# Altium schematic sheet D2_oldVersion.SchDoc
size A; SheetNumber: 1; SheetTotal: 1
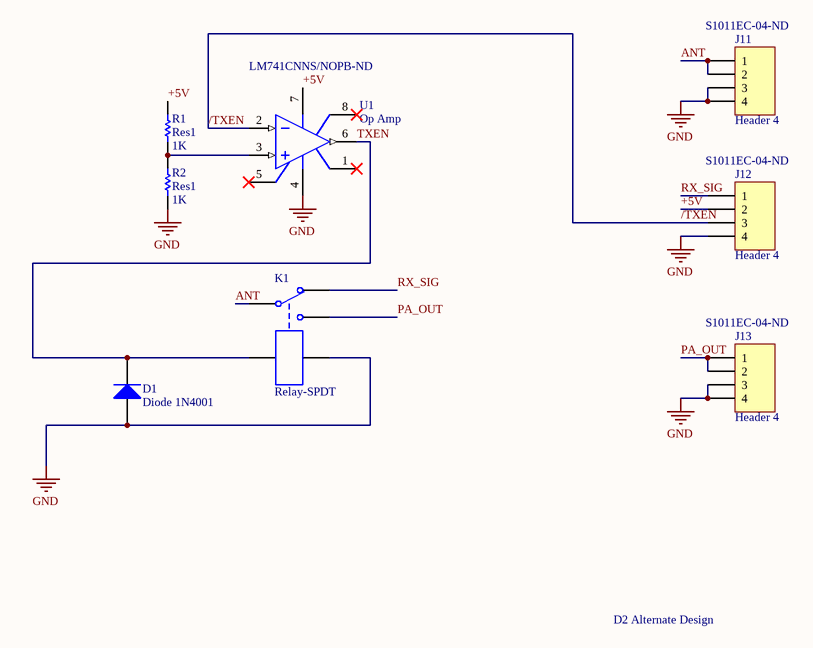
[diagram p0: D2_oldVersion.SchDoc]

## Parts
D1  Diode 1N4001  [DO-41]
J11  Header 4  Supplier Part Number 1: S1011EC-04-ND  [HDR1X4]
J12  Header 4  Supplier Part Number 1: S1011EC-04-ND  [HDR1X4]
J13  Header 4  Supplier Part Number 1: S1011EC-04-ND  [HDR1X4]
K1  Relay-SPDT  [MODULE5B]
R1  Res1  value 1K  [AXIAL-0.1-RES]
R2  Res1  value 1K  [AXIAL-0.1-RES]
U1  Op Amp  Supplier Part Number 1: LM741CNNS/NOPB-ND  [H-08A]

## Nets
GND: D1.1(A) J11.3 J11.4 J12.4 J13.3 J13.4 K1.5 R2.1 U1.4(V-)
+5V: J12.2 R1.2 U1.7(V+)
/TXEN: J12.3 U1.2(IN-)
ANT: J11.1 J11.2 K1.1
PA_OUT: J13.1 J13.2 K1.3
RX_SIG: J12.1 K1.2
TXEN: D1.2(K) K1.4 U1.6(OUT)
NetR1_1: R1.1 R2.2 U1.3(IN+)

Not connected (* = marked no-connect by the designer): U1 1(OS_NUL)* 5(OS_NUL)* 8(TAB)*

## Notes on the sheet
- D2 Alternate Design

## Library data of the parts
D1 = Diode 1N4001: 1 Amp General Purpose Rectifier; Published: 8-Jun-2000; LatestRevisionDate: 17-Jul-2002; LatestRevisionNote: Re-released for DXP Platform.; DatasheetVersion: 1998; PackageVersion: Aug-1999; PackageReference: DO-41; Publisher: Altium Limited; PackageDescription: Diode, Axial; Body 5.2 x 2.7 mm (LxDia. max), Lead Dia. 0.86 mm (max); Code_JEDEC: DO-204-AL; ComponentLink1Description: Manufacturer Link; ComponentLink1URL: http://www.fairchildsemi.com/; ComponentLink2Description: Datasheet; ComponentLink2URL: http://www.fairchildsemi.com/ds/1N%2F1N4001.pdf
J11-J13 = Header 4: Conn Header Vert 4POS 2.54MM; Manufacturer: Sullins; Manufacturer Part Number: PRPC004SAAN-RC; Number of Positions: 4; Connector Type: Male Pin; Pitch: 0.1inch; LatestRevisionDate: 17-Jul-2002; LatestRevisionNote: Re-released for DXP Platform.; Publisher: Altium Limited; Supplier 1: Digi-Key; RoHS: Yes; Category: Connectors; Stock 1: 11511; Pricing 1: 1=0.15000, 10=0.14600, 25=0.10840, 50=0.09280, 100=0.08980, 250=0.07740, 500=0.07430 (USD); Mount: Through Hole; Color: Black; Contact Plating: Gold; Package Quantity: 1; Number of Rows: 1; Packaging: Bulk; Termination: Solder; Series: -; Contact Type: Male Pin; Contact Mating Length: 0.23inch; RoHS Compliant: Yes; ComponentLink1URL: https://datasheet.ciiva.com/741/xrxczzzsxxn-rc-st-11635-b-741241.pdf?src-supplier=Digi-Key; ComponentLink1Description: https://datasheet.ciiva.com/741/xrxczzzsxxn-rc-st-11635-b-741241.pdf?src-supplier=Digi-Key
K1 = Relay-SPDT: Single-Pole Dual-Throw Relay; Published: 24-Mar-1999; LatestRevisionDate: 17-Jul-2002; LatestRevisionNote: Re-released for DXP Platform.; PackageReference: MODULE5B; Publisher: Altium Limited
R1 R2 = RES 1K OHM 5% 1/4W AXIAL: Resistor; Manufacturer Part Number: CFR-25JB-52-1K; Designator: R?; Power Rating: 1/4W; Tolerance: 0.05; Published: 8-Jun-2000; LatestRevisionDate: 17-Jul-2002; LatestRevisionNote: Re-released for DXP Platform.; Publisher: Altium Limited
U1 = Op Amp: Single 44V 1MHz operational amplifier 8-PDIP 0 to 70; Manufacturer: TI National Semiconductor; Manufacturer Part Number: LM741CN/NOPB; Gain Bandwidth Product: 1.5MHz; Slew Rate: 0.5V/µs; Number of Channels: 1; Input Bias Current: 80nA; Input Offset Voltage (Vos): 2mV; Voltage Gain: 106.02dB; Common Mode Rejection Ratio: 70dB; Max Dual Supply Voltage: 18V; Nominal Supply Current: 1.7mA; Output Current per Channel: 25mA; Power Dissipation: 500mW; Power Supply Rejection Ratio (PSRR): 77dB; Min Dual Supply Voltage: 5V; Amplifier Type: GENERAL PURPOSE; Max Supply Voltage: 36V; Min Supply Voltage: 10V; Max Supply Current: 2.8mA; Gain: 96dB; Published: 8-Jun-2000; LatestRevisionDate: 17-Jul-2002; LatestRevisionNote: Re-released for DXP Platform.; DatasheetVersion: REV. B; PackageVersion: 1990; PackageReference: H-08A; Publisher: Altium Limited; PackageDescription: Can; 8 Leads; Pin Circle Dia. 5.08 mm; Lead Dia. 0.53 mm (max); ComponentLink1Description: Manufacturer Link; ComponentLink1URL: http://www.analog.com/; Supplier 1: Digi-Key; RoHS: Yes; Category: Amplifiers - Op Amps, Buffer, Instrumentation; Stock 1: 4474; Pricing 1: 1=0.91000, 10=0.81300, 25=0.77160, 100=0.63390, 250=0.59256, 500=0.52364, 1000=0.45500 (USD); Mount: Through Hole; Case/Package: DIP; Number of Pins: 8; Contact Plating: Tin,Matte; Weight: 0.01lb; Min Operating Temperature: 0°C; Max Operating Temperature: 70°C; Packaging: Rail/Tube; Number of Elements: 1; Technology: BIPOLAR; Package Quantity: 40; Number of Circuits: 1; Operating Supply Current: 1.7mA; Output Current: 25mA; Supply Current: 1.7mA; Bandwidth: 1MHz; Number of Amplifiers: 1; Max Power Dissipation: 500mW; Voltage: 36V; Length: 9.27mm; Width: 6.35mm; Height: 3.3mm; Radiation Hardening: No; Lead Free: Lead Free; RoHS Compliant: Yes; REACH SVHC: No SVHC; ComponentLink2URL: https://datasheet.ciiva.com/26325/175935-da-01-en-ic-lm-741cn-nopb-dip8-tid-26325918.pdf?src-supplier=Conrad; ComponentLink2Description: https://datasheet.ciiva.com/26325/175935-da-01-en-ic-lm-741cn-nopb-dip8-tid-26325918.pdf?src-supplier=Conrad; ComponentLink3URL: https://datasheet.ciiva.com/26850/lm741cn-nopb-26850677.pdf?src-supplier=IIIC; ComponentLink3Description: https://datasheet.ciiva.com/26850/lm741cn-nopb-26850677.pdf?src-supplier=IIIC; ComponentLink4URL: https://datasheet.ciiva.com/14151/mflm741-data-e-14151370.pdf?src-supplier=Distrelec; ComponentLink4Description: https://datasheet.ciiva.com/14151/mflm741-data-e-14151370.pdf?src-supplier=Distrelec; ComponentLink5URL: https://datasheet.ciiva.com/8008/1862441-8008933.pdf?src-supplier=Element14; ComponentLink5Description: https://datasheet.ciiva.com/8008/1862441-8008933.pdf?src-supplier=Element14